# EAGLE board SBPB_FM_v2.3 (EAGLE 8.6.2), part 1 of 2
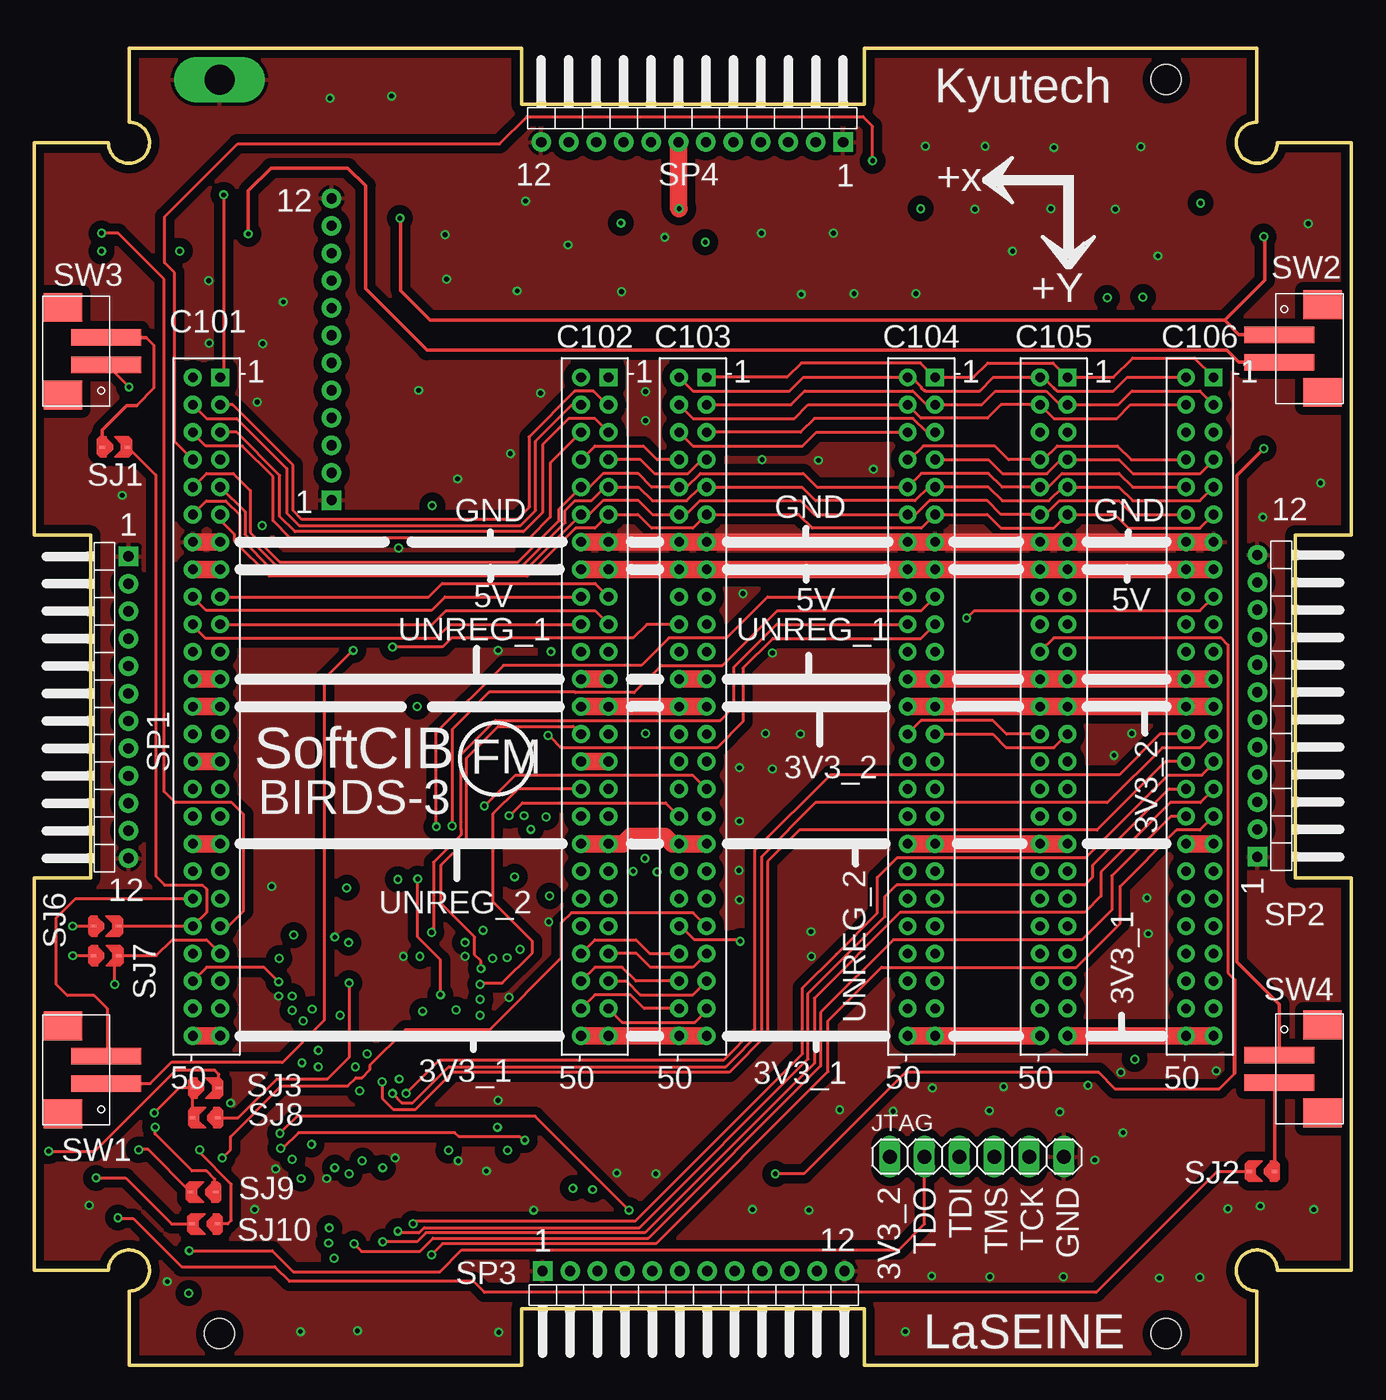
[diagram p2: board, top side]
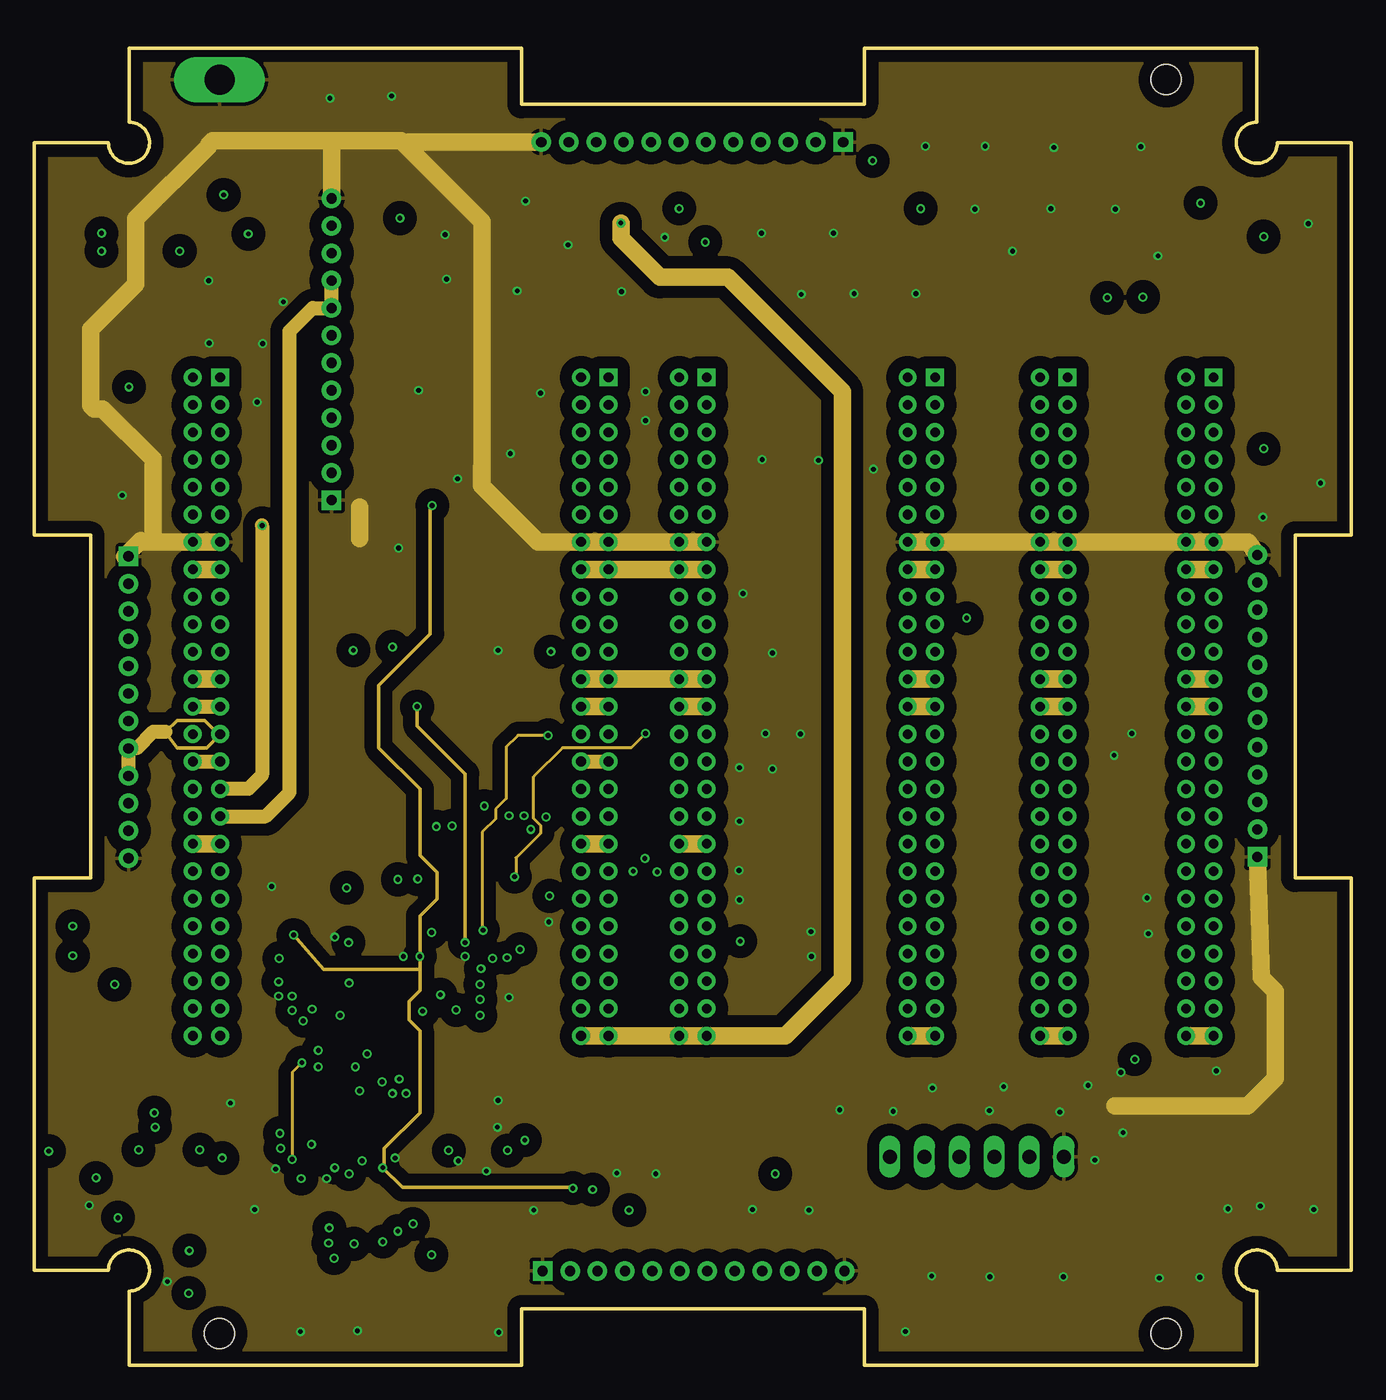
[diagram p3: board, inner layer L2_GND]
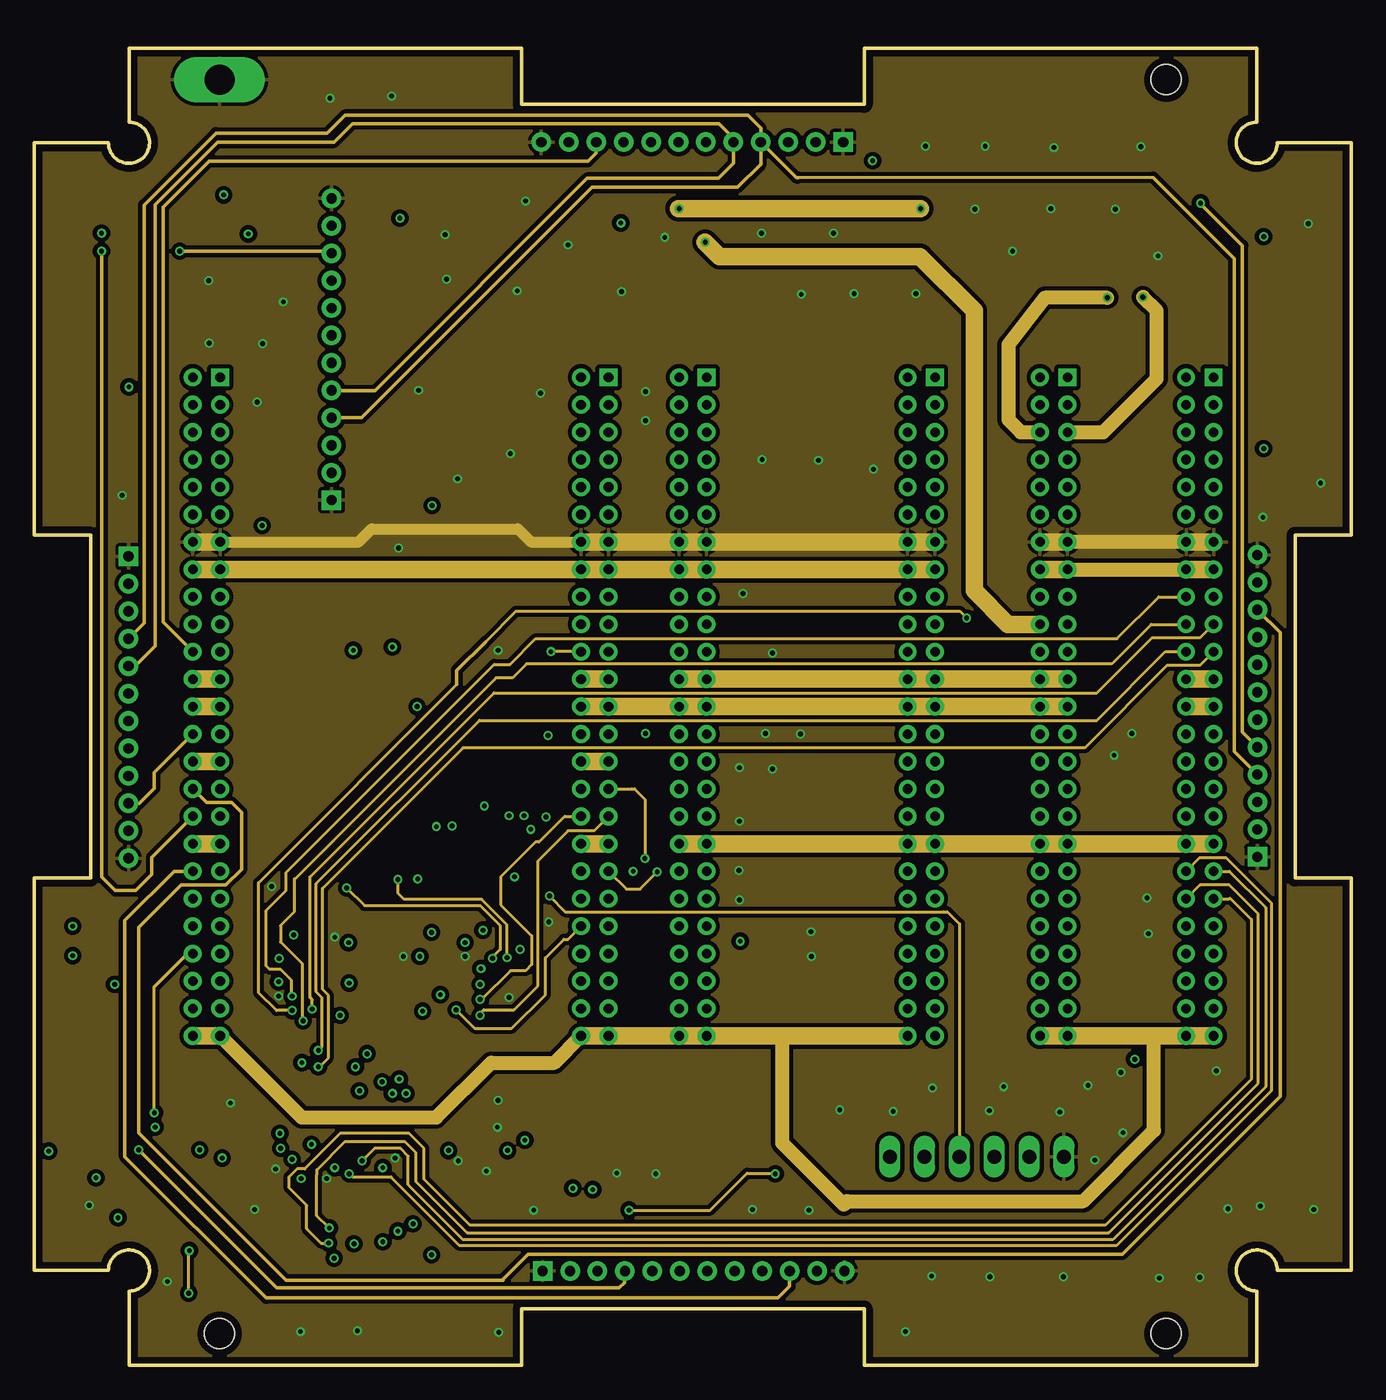
[diagram p4: board, inner layer L3]
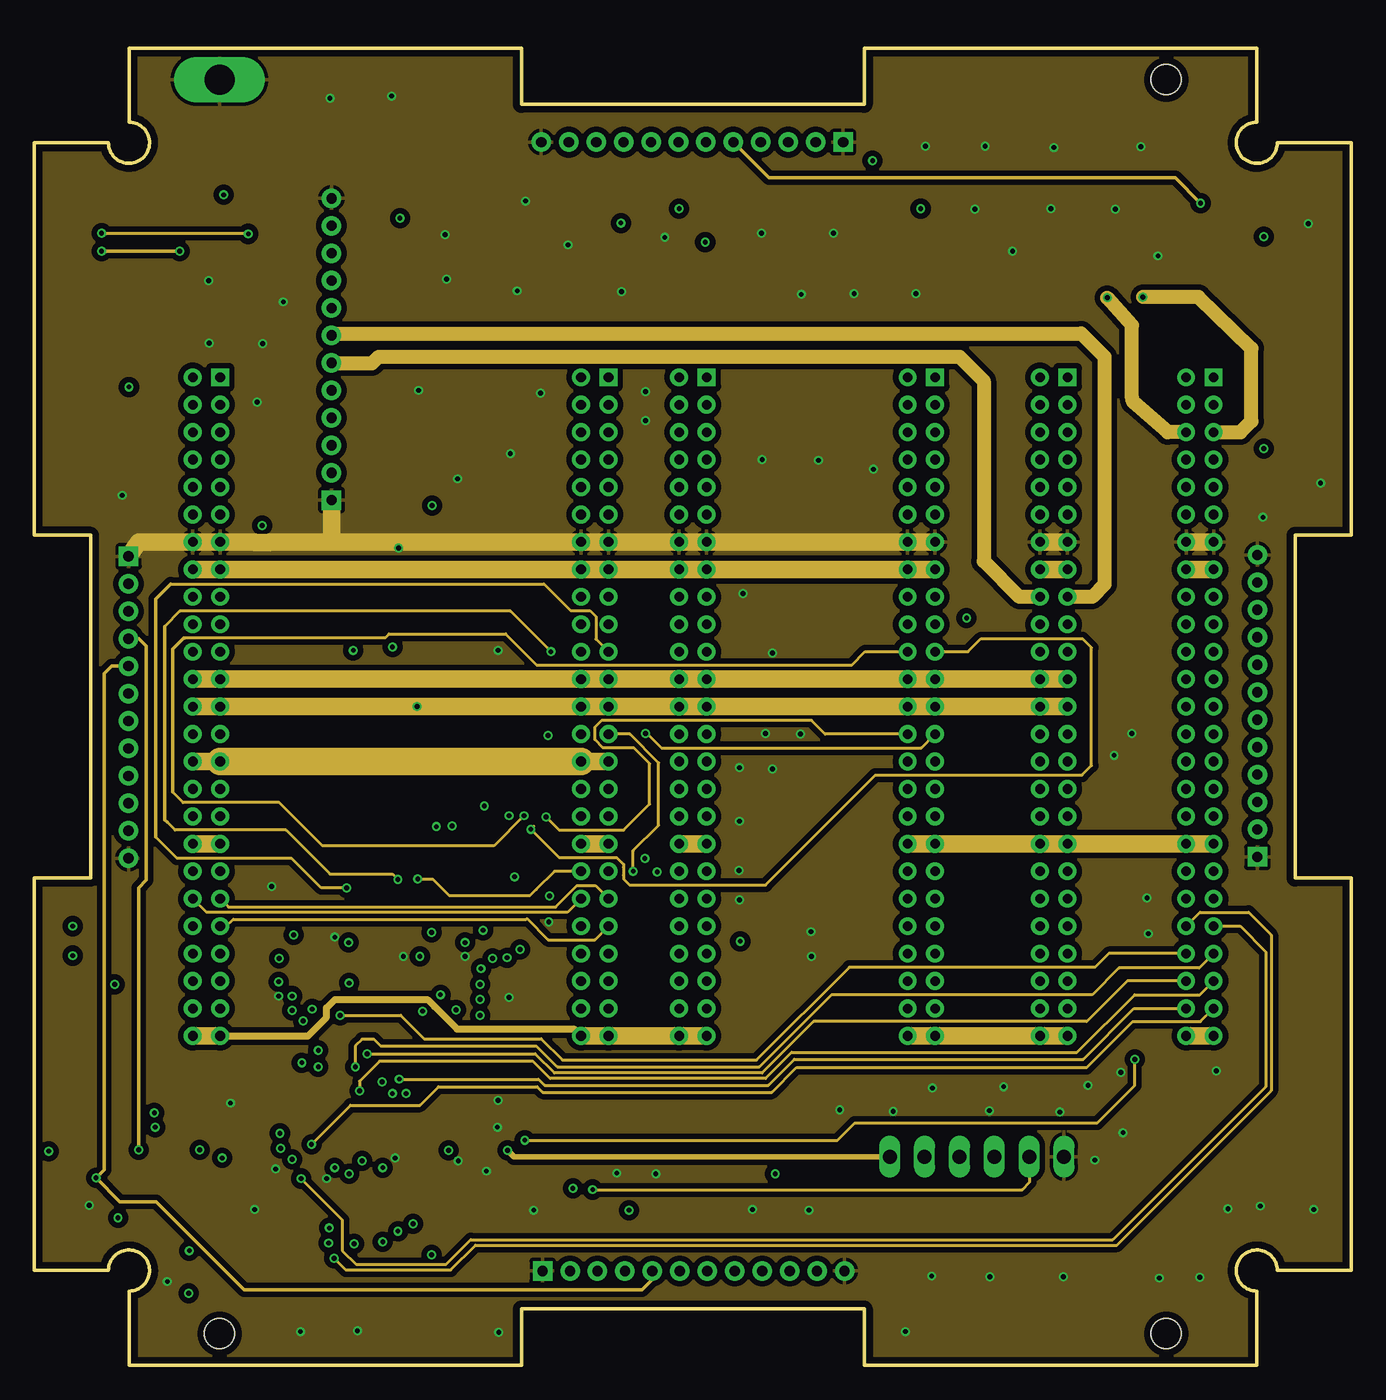
[diagram p5: board, inner layer L4]
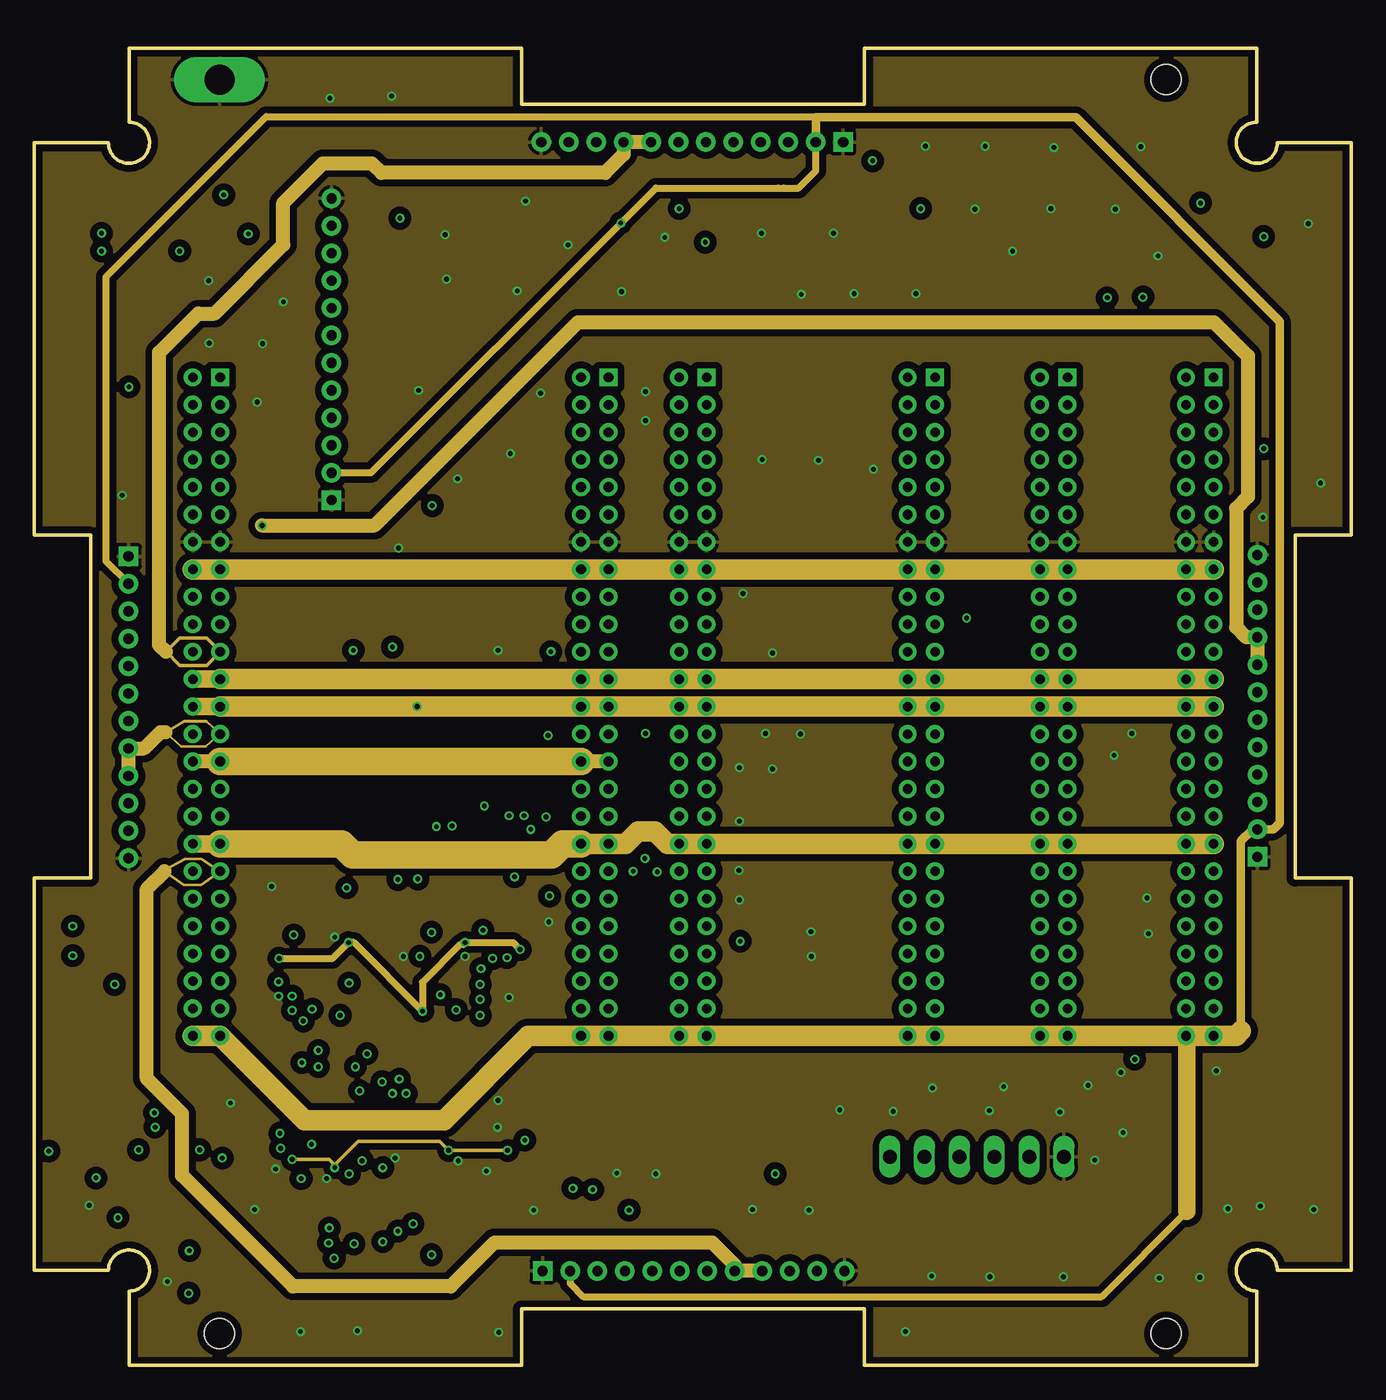
[diagram p6: board, inner layer L5_VCC]
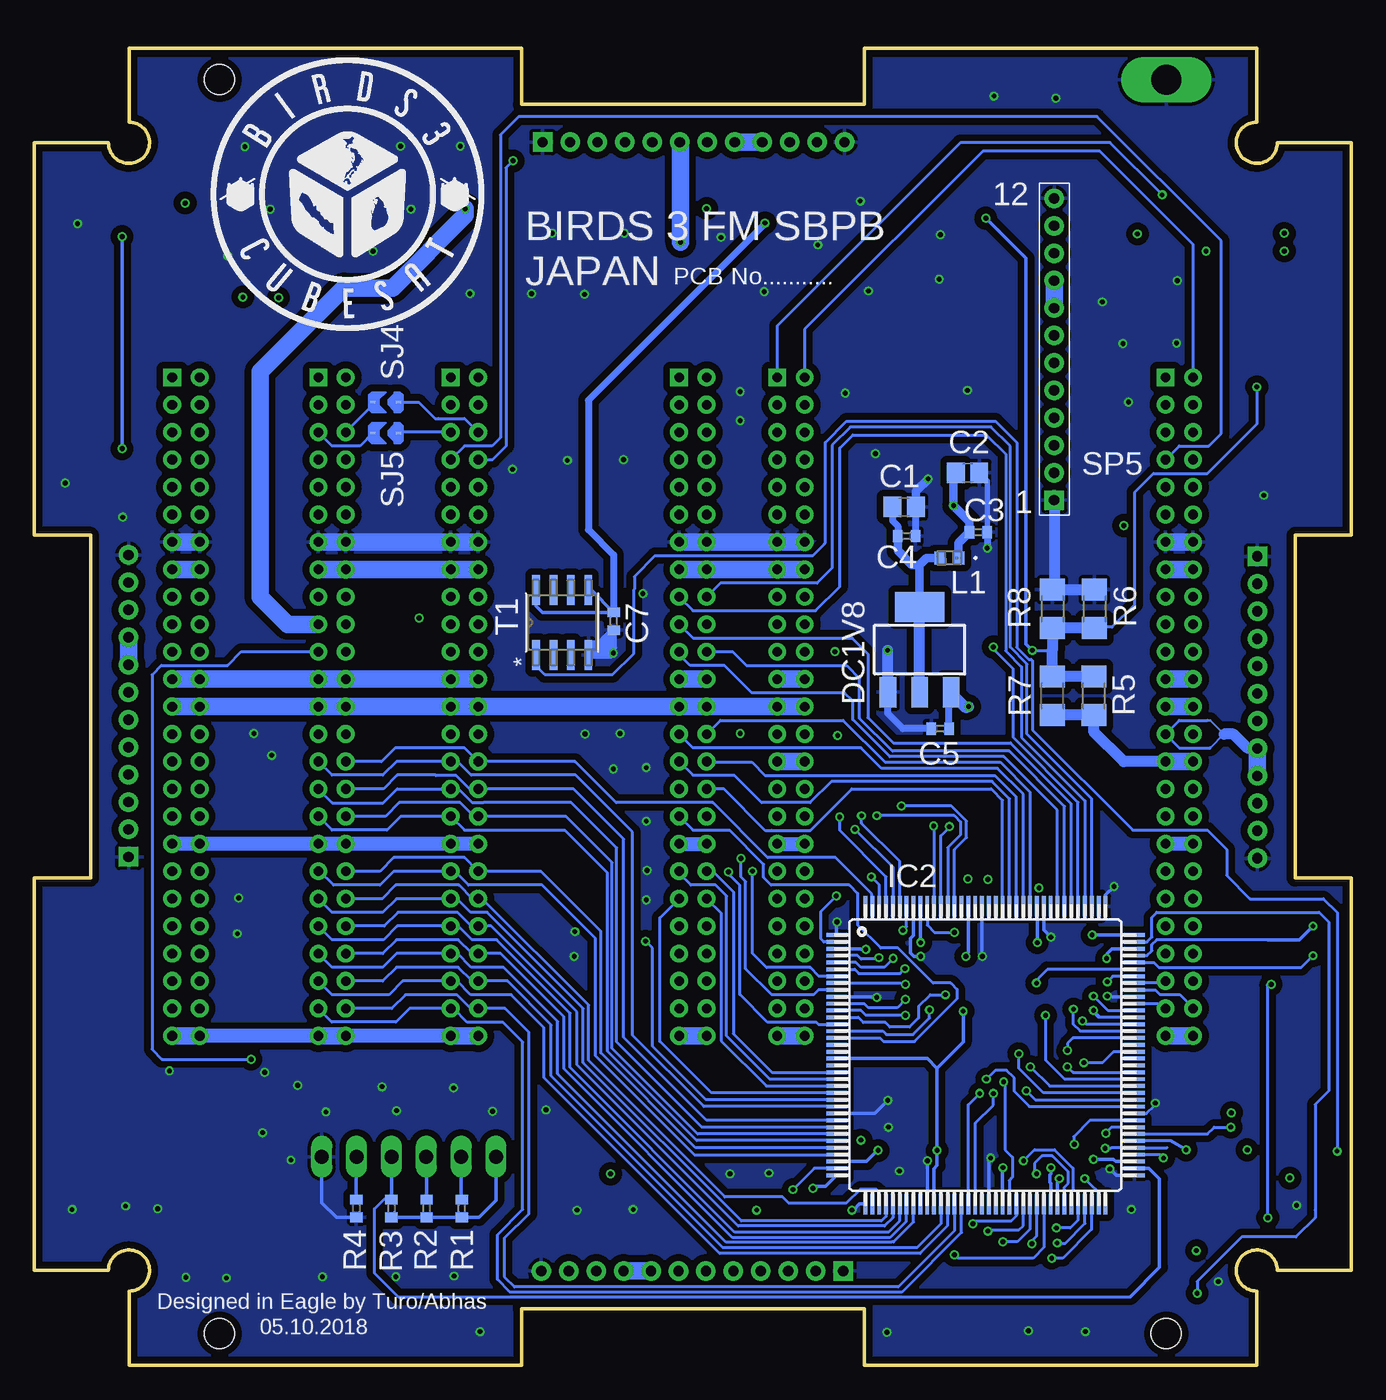
[diagram p7: board, bottom side, seen from below]

Size 96 x 96 mm. Coordinates in mm from the lower left corner, seen from the top.
Outline: 0,6.9 0,35.5 4.1,35.5 4.1,60.5 0,60.5 0,89.1 5.4,89.1 arc270 6.9,90.6 6.9,96 35.5,96 35.5,91.9 60.5,91.9 60.5,96 89.1,96 89.1,90.6 arc270 90.6,89.1 96,89.1 96,60.5 91.9,60.5 91.9,35.5 96,35.5 96,6.9 90.6,6.9 arc270 89.1,5.4 89.1,0 60.5,0 60.5,4.1 35.5,4.1 35.5,0 6.9,0 6.9,5.4 arc270 5.4,6.9 0,6.9
Copper layers (1+2*3*5*15+16): L1 0.018mm / dielectric 0.25mm / L2_GND 0.035mm / dielectric 0.25mm / L3 0.035mm / dielectric 0.2mm / L4 0.035mm / dielectric 0.2mm / L5_VCC 0.035mm / dielectric 0.25mm / L6 0.018mm
Design rules "pban_5mil_l4 *": minimum track width 5mil, minimum drill 0.3mm, track to track 5mil, track to pad 0.229mm, pad to pad 5mil, via to via 5mil, smd to smd 5mil, copper to edge 0.5mm, drill to drill 0.5mm, minimum pad ring 0.15mm, minimum via ring 0.15mm, stop-mask expansion 4mil, vias tented up to drill 0.35mm, thermal gap 10mil
Net classes: 1 GND: width 0.2 mm, clearance 0.127 mm; 2 POWER: width 0.2 mm, clearance 0.02 mm
Holes 2.2 mm at 13.5,2.3 82.5,2.3 82.5,93.7

## Footprints (pad centres in the part's own frame; a part is rotated, then mirrored left to right if it is on the bottom)
C2012 = smd 1.3 x 1.5: 1 -0.85,0; 2 0.85,0
C0402 = smd 0.7 x 0.9: 1 -0.65,0; 2 0.65,0
SHDR50W60P200_2X25_5000X400X44_TR = drill 0.7 pad 1.3 square: P$1 0,2 | drill 0.7 pad 1.3: P$2 0,0; P$3 2,2; P$4 2,0; P$5 4,2; P$6 4,0; P$7 6,2; P$8 6,0; P$9 8,2; P$10 8,0; P$11 10,2; P$12 10,0; P$13 12,2; P$14 12,0; P$15 14,2; P$16 14,0; P$17 16,2; P$18 16,0; P$19 18,2; P$20 18,0; P$21 20,2; P$22 20,0; P$23 22,2; P$24 22,0; P$25 24,2; P$26 24,0; P$27 26,2; P$28 26,0; P$29 28,2; P$30 28,0; P$31 30,2; P$32 30,0; P$33 32,2; P$34 32,0; P$35 34,2; P$36 34,0; P$37 36,2; P$38 36,0; P$39 38,2; P$40 38,0; P$41 40,2; P$42 40,0; P$43 42,2; P$44 42,0; P$45 44,2; P$46 44,0; P$47 46,2; P$48 46,0; P$49 48,2; P$50 48,0
SOT223 = smd 1.219 x 2.235: 1 -2.311,-3.099; 2 0,-3.099; 3 2.311,-3.099 | smd 3.6 x 2.2: 4 0,3.099
TQFP144 = smd 1.5 x 0.285: 1 -10.85,8.75; 2 -10.85,8.25; 3 -10.85,7.75; 4 -10.85,7.25; 5 -10.85,6.75; 6 -10.85,6.25; 7 -10.85,5.75; 8 -10.85,5.25; 9 -10.85,4.75; 10 -10.85,4.25; 11 -10.85,3.75; 12 -10.85,3.25; 13 -10.85,2.75; 14 -10.85,2.25; 15 -10.85,1.75; 16 -10.85,1.25; 17 -10.85,0.75; 18 -10.85,0.25; 19 -10.85,-0.25; 20 -10.85,-0.75; 21 -10.85,-1.25; 22 -10.85,-1.75; 23 -10.85,-2.25; 24 -10.85,-2.75; 25 -10.85,-3.25; 26 -10.85,-3.75; 27 -10.85,-4.25; 28 -10.85,-4.75; 29 -10.85,-5.25; 30 -10.85,-5.75; 31 -10.85,-6.25; 32 -10.85,-6.75; 33 -10.85,-7.25; 34 -10.85,-7.75; 35 -10.85,-8.25; 36 -10.85,-8.75; 73 10.85,-8.75; 74 10.85,-8.25; 75 10.85,-7.75; 76 10.85,-7.25; 77 10.85,-6.75; 78 10.85,-6.25; 79 10.85,-5.75; 80 10.85,-5.25; 81 10.85,-4.75; 82 10.85,-4.25; 83 10.85,-3.75; 84 10.85,-3.25; 85 10.85,-2.75; 86 10.85,-2.25; 87 10.85,-1.75; 88 10.85,-1.25; 89 10.85,-0.75; 90 10.85,-0.25; 91 10.85,0.25; 92 10.85,0.75; 93 10.85,1.25; 94 10.85,1.75; 95 10.85,2.25; 96 10.85,2.75; 97 10.85,3.25; 98 10.85,3.75; 99 10.85,4.25; 100 10.85,4.75; 101 10.85,5.25; 102 10.85,5.75; 103 10.85,6.25; 104 10.85,6.75; 105 10.85,7.25; 106 10.85,7.75; 107 10.85,8.25; 108 10.85,8.75 | smd 0.285 x 1.5: 37 -8.75,-10.85; 38 -8.25,-10.85; 39 -7.75,-10.85; 40 -7.25,-10.85; 41 -6.75,-10.85; 42 -6.25,-10.85; 43 -5.75,-10.85; 44 -5.25,-10.85; 45 -4.75,-10.85; 46 -4.25,-10.85; 47 -3.75,-10.85; 48 -3.25,-10.85; 49 -2.75,-10.85; 50 -2.25,-10.85; 51 -1.75,-10.85; 52 -1.25,-10.85; 53 -0.75,-10.85; 54 -0.25,-10.85; 55 0.25,-10.85; 56 0.75,-10.85; 57 1.25,-10.85; 58 1.75,-10.85; 59 2.25,-10.85; 60 2.75,-10.85; 61 3.25,-10.85; 62 3.75,-10.85; 63 4.25,-10.85; 64 4.75,-10.85; 65 5.25,-10.85; 66 5.75,-10.85; 67 6.25,-10.85; 68 6.75,-10.85; 69 7.25,-10.85; 70 7.75,-10.85; 71 8.25,-10.85; 72 8.75,-10.85; 109 8.75,10.85; 110 8.25,10.85; 111 7.75,10.85; 112 7.25,10.85; 113 6.75,10.85; 114 6.25,10.85; 115 5.75,10.85; 116 5.25,10.85; 117 4.75,10.85; 118 4.25,10.85; 119 3.75,10.85; 120 3.25,10.85; 121 2.75,10.85; 122 2.25,10.85; 123 1.75,10.85; 124 1.25,10.85; 125 0.75,10.85; 126 0.25,10.85; 127 -0.25,10.85; 128 -0.75,10.85; 129 -1.25,10.85; 130 -1.75,10.85; 131 -2.25,10.85; 132 -2.75,10.85; 133 -3.25,10.85; 134 -3.75,10.85; 135 -4.25,10.85; 136 -4.75,10.85; 137 -5.25,10.85; 138 -5.75,10.85; 139 -6.25,10.85; 140 -6.75,10.85; 141 -7.25,10.85; 142 -7.75,10.85; 143 -8.25,10.85; 144 -8.75,10.85
1X06 = drill 1.016 long: 1 -6.35,0; 2 -3.81,0; 3 -1.27,0; 4 1.27,0; 5 3.81,0; 6 6.35,0
IND_BLM18_0603 = smd 0.813 x 0.94: 1 -0.673,0; 2 0.673,0
R0402 = smd 0.7 x 0.9: 1 -0.65,0; 2 0.65,0
R3216 = smd 1.6 x 1.8: 1 -1.4,0; 2 1.4,0
SJ_TURO = smd 0.406 x 0.203: 1 -0.7,0; 2 1.15,0
PIN1X12/90 = drill 0.75 pad 1.422 square: 1 -0.048,-0.063 | drill 0.75 pad 1.422: 2 -2.048,-0.063; 3 -4.048,-0.063; 4 -6.048,-0.063; 5 -8.048,-0.063; 6 -10.048,-0.063; 7 -12.048,-0.063; 8 -14.048,-0.063; 9 -16.048,-0.063; 10 -18.048,-0.063; 11 -20.048,-0.063; 12 -22.048,-0.063
PIN1X12 = drill 0.75 pad 1.422 square: 1 -0.048,-0.063 | drill 0.75 pad 1.422: 2 -2.048,-0.063; 3 -4.048,-0.063; 4 -6.048,-0.063; 5 -8.048,-0.063; 6 -10.048,-0.063; 7 -12.048,-0.063; 8 -14.048,-0.063; 9 -16.048,-0.063; 10 -18.048,-0.063; 11 -20.048,-0.063; 12 -22.048,-0.063
MOLEX-CONN-2-BIRDS = smd 1.2 x 5.1: 1 2.6,2.55; 2 0.6,2.55 | smd 2.1 x 2.8: P$3 -1.6,-0.6; P$4 4.8,-0.6
R_8 = smd 2.184 x 0.559: 1 -2.362,1.905; 2 -2.362,0.635; 3 -2.362,-0.635; 4 -2.362,-1.905; 5 2.362,-1.905; 6 2.362,-0.635; 7 2.362,0.635; 8 2.362,1.905
GND_PAD = drill 2.2 pad 3.3 long: GND_PAD 0,0

## Placement (x,y rotation side)
C1  22uF  [C2012]  32.6,62.56 0 bottom
C2  4.7uF  [C2012]  27.98,65.04 0 bottom
C3  0.1uF  [C0402]  27.19,60.71 0 bottom
C4  0.1uF  [C0402]  32.42,60.44 0 bottom
C5  0.1uF  [C0402]  29.98,46.4 180 bottom
C7  0.1uF  [C0402]  53.77,54.23 270 bottom
C101  A3C-50DA-2DSA(71)_TUROA3C-50A-2DSA  [SHDR50W60P200_2X25_5000X400X44_TR]  11.55,72 270 top
C102  A3C-50DA-2DSA(71)_TUROA3C-50A-2DSA  [SHDR50W60P200_2X25_5000X400X44_TR]  39.85,72 270 top
C103  A3C-50DA-2DSA(71)_TUROA3C-50A-2DSA  [SHDR50W60P200_2X25_5000X400X44_TR]  47,72 270 top
C104  A3C-50DA-2DSA(71)_TUROA3C-50A-2DSA  [SHDR50W60P200_2X25_5000X400X44_TR]  63.65,72 270 top
C105  A3C-50DA-2DSA(71)_TUROA3C-50A-2DSA  [SHDR50W60P200_2X25_5000X400X44_TR]  73.3,72 270 top
C106  A3C-50DA-2DSA(71)_TUROA3C-50A-2DSA  [SHDR50W60P200_2X25_5000X400X44_TR]  83.95,72 270 top
DC1V8  NCV1117ST18T3G  [SOT223]  31.48,52.15 0 bottom
IC2  LC4256ZE_XXTN144  [TQFP144]  26.68,22.6 0 bottom
JTAG  [1X06]  68.7,15.2 0 top
L1  BLM18AG601SN1D  [IND_BLM18_0603]  29.31,58.83 180 bottom
R1  5k6  [R0402]  64.85,11.43 270 bottom
R2  5k6  [R0402]  67.41,11.43 270 bottom
R3  5k6  [R0402]  69.97,11.43 270 bottom
R4  5k6  [R0402]  72.53,11.43 90 bottom
R5  0R  [R3216]  18.77,48.8 90 bottom
R6  0R  [R3216]  18.74,55.12 270 bottom
R7  0R  [R3216]  21.8,48.8 90 bottom
R8  0R  [R3216]  21.8,55.12 270 bottom
SJ1  SJ_BY_TURO  [SJ_TURO]  6.1,66.92 180 top
SJ2  0R  [SJ_TURO]  89.25,14.14 0 top
SJ3  SJ_BY_TURO  [SJ_TURO]  12.74,20.2 180 top
SJ4  SJ_BY_TURO  [SJ_TURO]  70.62,70.19 0 bottom
SJ5  SJ_BY_TURO  [SJ_TURO]  70.62,67.94 0 bottom
SJ6  SJ_BY_TURO  [SJ_TURO]  5.45,32 180 top
SJ7  SJ_BY_TURO  [SJ_TURO]  5.47,29.85 180 top
SJ8  SJ_BY_TURO  [SJ_TURO]  12.24,18.03 0 top
SJ9  SJ_BY_TURO  [SJ_TURO]  12.09,12.62 0 top
SJ10  SJ_BY_TURO  [SJ_TURO]  12.19,10.3 0 top
SP1  PSR-210154-12  [PIN1X12/90]  6.8,59 90 top
SP2  PSR-210154-12  [PIN1X12/90]  89.2,37 270 top
SP3  PSR-210154-12  [PIN1X12/90]  37,6.8 180 top
SP4  PSR-210154-12  [PIN1X12/90]  59,89.2 0 top
SP5  PSS-210204-12  [PIN1X12]  21.6,63 270 bottom
SW1  MOLEX-CONN-2-0554600272  [MOLEX-CONN-2-BIRDS]  2.7,23.12 270 top
SW2  MOLEX-CONN-2-0554600272  [MOLEX-CONN-2-BIRDS]  93.3,72.5 90 top
SW3  MOLEX-CONN-2-0554600272  [MOLEX-CONN-2-BIRDS]  2.7,75.5 270 top
SW4  MOLEX-CONN-2-0554600272  [MOLEX-CONN-2-BIRDS]  93.3,20 90 top
T1  TMP36FSZ-REEL  [R_8]  57.52,54.12 90 bottom
U$1  GND_PAD  [GND_PAD]  13.5,93.7 0 top